# Altium schematic sheet Sheet1.SchDoc
size A4; SheetNumber: 1; SheetTotal: 1
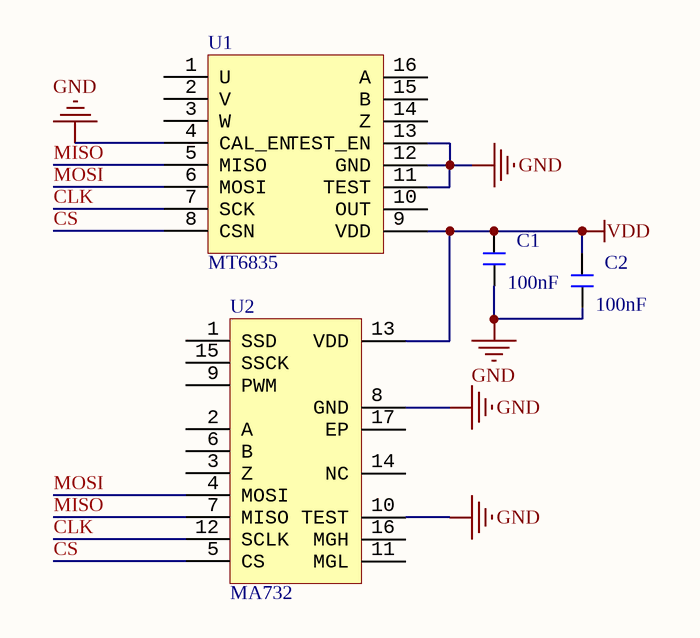
[diagram p0: Sheet1.SchDoc]

## Parts
C1  100nF  [C 0402_L]
C2  100nF  [C 0402_L]
U1  MT6835  [TSSOP16_L]
U2  MA732  [QFN16 3X3]

## Nets
GND: C1.1 C2.1 U1.4(CAL_EN) U1.11(TEST) U1.12(GND) U1.13(TEST_EN) U2.8(GND) U2.10(TEST)
VDD: C1.2 C2.2 U1.9(VDD) U2.13(VDD)
CLK: U1.7(SCK) U2.12(SCLK)
CS: U1.8(CSN) U2.5(CS)
MISO: U1.5(MISO) U2.7(MISO)
MOSI: U1.6(MOSI) U2.4(MOSI)

Not connected (* = marked no-connect by the designer): U1 1(U) 2(V) 3(W) 10(OUT) 14(Z) 15(B) 16(A); U2 1(SSD) 2(A) 3(Z) 6(B) 9(PWM) 11(MGL) 14(NC) 15(SSCK) 16(MGH) 17(EP)

## Library data of the parts
C1 C2 = C: 无极性贴片电容; 版权归属: 源创客; BOM名称: 无极性贴片电容; 学习资源: www.ooocke.com
U1 = MT6835: 21bit磁编码芯片
U2 = MA732: 14bit编码器芯片